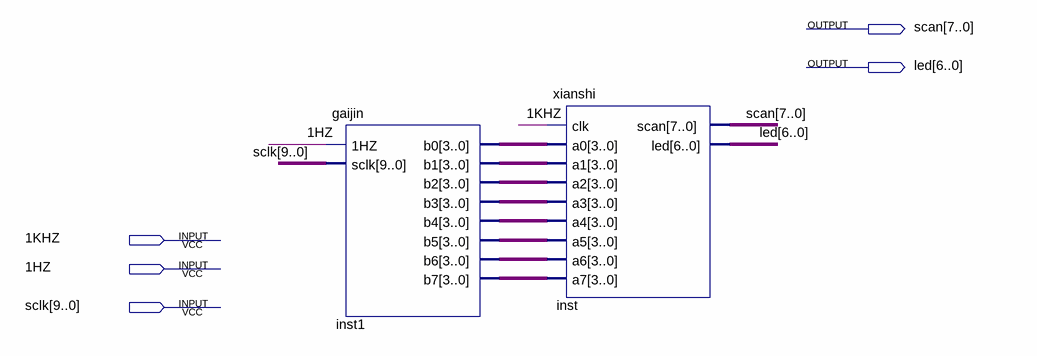
[diagram p0: schematic sheet]
// Quartus schematic jixian.bdf as structural Verilog: 2 symbols, 5 pins
module jixian (
  input  \1KHZ ,
  input  \1HZ ,
  input  [9:0] sclk,
  output [7:0] scan,
  output [6:0] led
);

  wire [3:0] inst1_b0, inst1_b1, inst1_b2, inst1_b3, inst1_b4, inst1_b5, inst1_b6, inst1_b7;

  gaijin inst1 (
    .\1HZ (\1HZ ), .sclk(sclk), .b0(inst1_b0), .b1(inst1_b1), .b2(inst1_b2), .b3(inst1_b3), .b4(inst1_b4),
    .b5(inst1_b5), .b6(inst1_b6), .b7(inst1_b7));
  xianshi inst (
    .clk(\1KHZ ), .a0(inst1_b0), .a1(inst1_b1), .a2(inst1_b2), .a3(inst1_b3), .a4(inst1_b4), .a5(inst1_b5),
    .a6(inst1_b6), .a7(inst1_b7), .scan(scan), .led(led));
endmodule
